# Altium schematic sheet Beacon.SchDoc
size A3
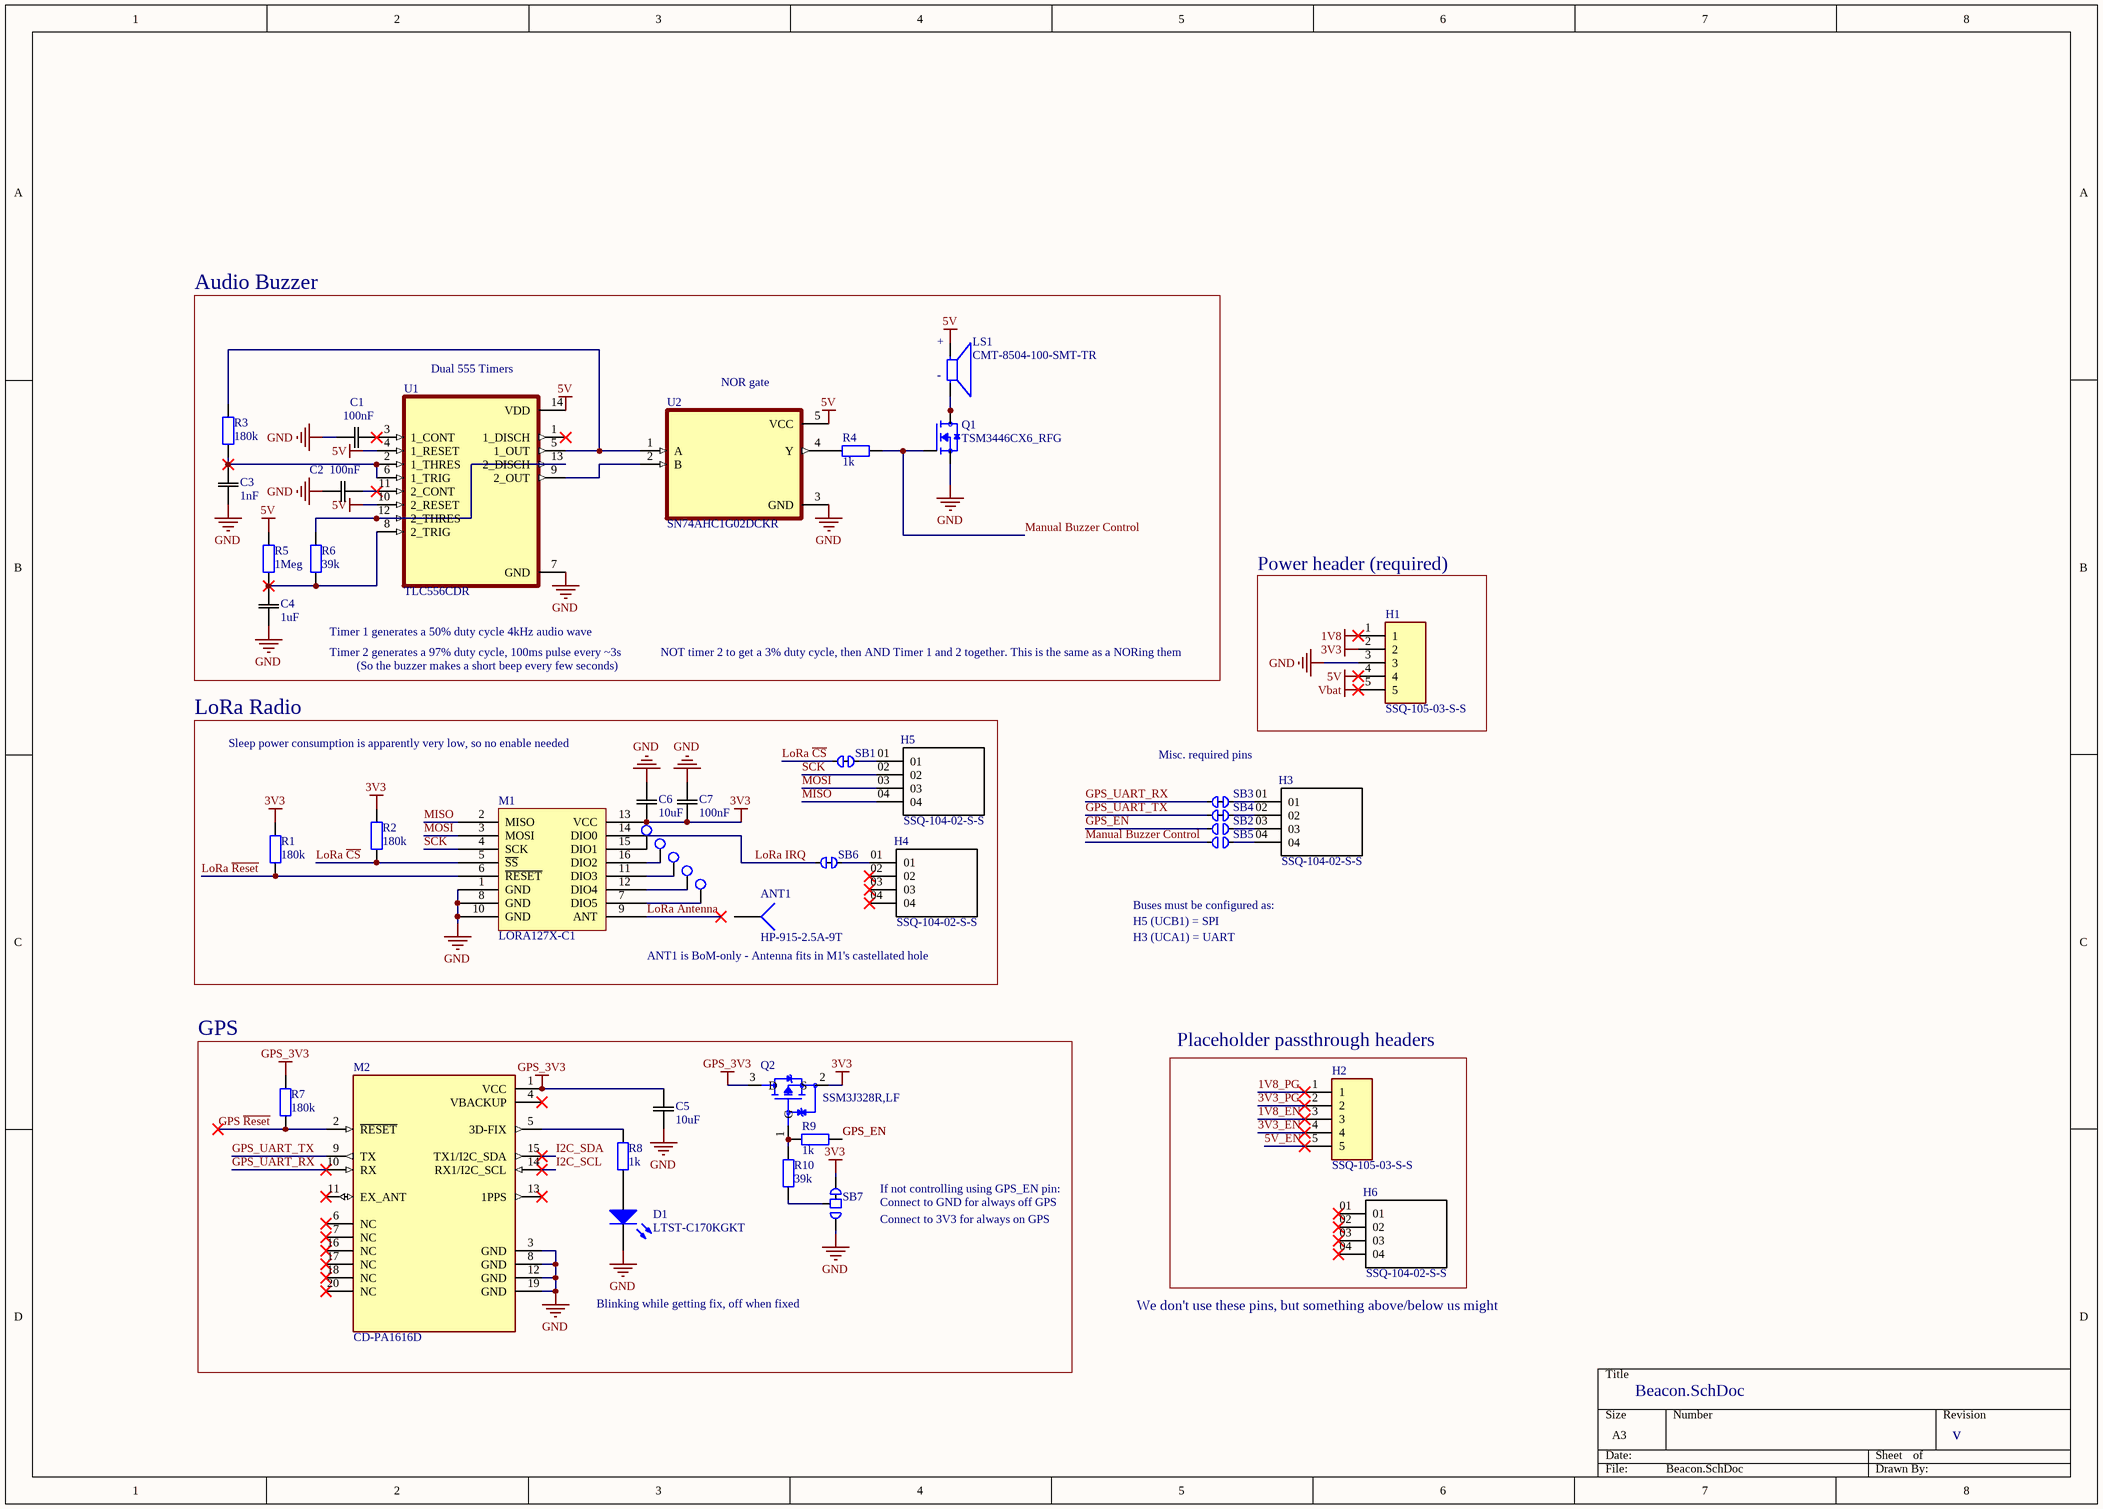
[diagram p0: Beacon.SchDoc]

## Parts
ANT1  HP-915-2.5A-9T  (mechanical)
C1  100nF  [CAPC2012X94N]
C2  100nF  [CAPC2012X94N]
C3  1nF  [CAPC2012X94N]
C4  1uF  [CAPC2012X94N]
C5  10uF  [CAPC2012X94N]
C6  10uF  [CAPC2012X94N]
C7  100nF  [CAPC2012X94N]
D1  LTST-C170KGKT  [ECE-LED2012-0805SM]
H1  SSQ-105-03-S-S  [SAMTEC_SSQ-105-03-S-S]  (no BOM)
H2  SSQ-105-03-S-S  [SAMTEC_SSQ-105-03-S-S]  (no BOM)
H3  SSQ-104-02-S-S  [*SAMTEC_SSQ-104-02-S-S_SSQ-104-02-S-S(Primary)]  (no BOM)
H4  SSQ-104-02-S-S  [*SAMTEC_SSQ-104-02-S-S_SSQ-104-02-S-S(Primary)]  (no BOM)
H5  SSQ-104-02-S-S  [*SAMTEC_SSQ-104-02-S-S_SSQ-104-02-S-S(Primary)]  (no BOM)
H6  SSQ-104-02-S-S  [*SAMTEC_SSQ-104-02-S-S_SSQ-104-02-S-S(Primary)]  (no BOM)
LS1  CMT-8504-100-SMT-TR  [XDCR_CMT-8504-100-SMT-TR]
M1  LORA127X-C1  [LoRa127X-C1]
M2  CD-PA1616D  [XCVR_CD-PA1616D]
Q1  TSM3446CX6_RFG  [SOT-26-6]
Q2  SSM3J328R,LF  [SOT95P240X88-3N]
R1  180k  [0805]
R2  180k  [0805]
R3  180k  [0805]
R4  1k  [0805]
R5  1Meg  [0805]
R6  39k  [0805]
R7  180k  [0805]
R8  1k  [0805]
R9  1k  [0805]
R10  39k  [0805]
SB1  Solder Jumper Normally Closed 0201  [Solder Bridge Closed 0201]  (value not drawn)  (net tie, no BOM)
SB2  Solder Jumper Normally Open 0201  [Solder Bridge Open 0201]  (value not drawn)  (no BOM)
SB3  Solder Jumper Normally Closed 0201  [Solder Bridge Closed 0201]  (value not drawn)  (net tie, no BOM)
SB4  Solder Jumper Normally Closed 0201  [Solder Bridge Closed 0201]  (value not drawn)  (net tie, no BOM)
SB5  Solder Jumper Normally Open 0201  [Solder Bridge Open 0201]  (value not drawn)  (no BOM)
SB6  Solder Jumper Normally Closed 0201  [Solder Bridge Closed 0201]  (value not drawn)  (net tie, no BOM)
SB7  Solder Jumper 3-pin Left connected 0201  [Solder Bridge 3-pin Left shorted 0201]  (value not drawn)  (net tie, no BOM)
T1  Test Pad  [Test Pad]  (value not drawn)  (no BOM)
T2  Test Pad  [Test Pad]  (value not drawn)  (no BOM)
T3  Test Pad  [Test Pad]  (value not drawn)  (no BOM)
T4  Test Pad  [Test Pad]  (value not drawn)  (no BOM)
T5  Test Pad  [Test Pad]  (value not drawn)  (no BOM)
U1  TLC556CDR  [SOIC127P600X175-14N]
U2  SN74AHC1G02DCKR  [SOT65P210X110-5N]

## Blocks framed on the sheet
Audio Buzzer: C1-C4 LS1 Q1 R3-R6 U1 U2
Power header (required): H1
LoRa Radio: ANT1 C6 C7 H4 H5 M1 R1 R2 SB1 SB6 T1-T5
GPS: C5 D1 M2 Q2 R7-R10 SB7
Placeholder passthrough headers: H2 H6

## Nets
1V8: H1.1
3V3: C6.2 C7.1 H1.2 M1.13(VCC) Q2.2(S) R1.2 R2.2 SB7.2
5V: H1.4 LS1.P R5.2 U1.4(1_RESET) U1.10(2_RESET) U1.14(VDD) U2.5(VCC)
GND: C1.1 C2.1 C3.1 C4.1 C5.1 C6.1 C7.2 D1.2(K) H1.3 M1.1(GND) M1.8(GND) M1.10(GND) M2.3(GND) M2.8(GND) M2.12(GND) M2.19(GND) Q1.4(S) SB7.3 U1.7(GND) U2.3(GND)
GPS_3V3: C5.2 M2.1(VCC) Q2.3(D) R7.2
Vbat: H1.5
1V8_EN: H2.3
1V8_PG: H2.1
3V3_EN: H2.4
3V3_PG: H2.2
5V_EN: H2.5
GPS ~{Reset}: M2.2(~{RESET}) R7.1
GPS_EN: R9.1 SB2.1
GPS_UART_RX: M2.10(RX) SB3.1
GPS_UART_TX: M2.9(TX) SB4.1
I2C_SCL: M2.14(RX1/I2C_SCL)
I2C_SDA: M2.15(TX1/I2C_SDA)
LoRa Antenna: M1.9(ANT)
LoRa ~{CS}: M1.5(~{SS}) R2.1 SB1.1
LoRa IRQ: M1.14(DIO0) SB6.1
LoRa ~{Reset}: M1.6(~{RESET}) R1.1
Manual Buzzer Control: Q1.3(G) R4.1 SB5.1
MISO: H5.04 M1.2(MISO)
MOSI: H5.03 M1.3(MOSI)
SCK: H5.02 M1.4(SCK)
NetC1_2: C1.2 U1.3(1_CONT)
NetC2_2: C2.2 U1.11(2_CONT)
NetC3_2: C3.2 R3.2 U1.2(1_THRES) U1.6(1_TRIG)
NetC4_2: C4.2 R5.1 R6.1 U1.8(2_TRIG)
NetD1_1: D1.1(A) R8.1
NetH3_01: H3.01 SB3.2
NetH3_02: H3.02 SB4.2
NetH3_03: H3.03 SB2.2
NetH3_04: H3.04 SB5.2
NetH4_01: H4.01 SB6.2
NetH5_01: H5.01 SB1.2
NetLS1_N: LS1.N Q1.1(D) Q1.2(D) Q1.5(D) Q1.6(D)
NetM1_7: M1.7(DIO5) T5.1
NetM1_11: M1.11(DIO3) T3.1
NetM1_12: M1.12(DIO4) T4.1
NetM1_15: M1.15(DIO1) T1.1
NetM1_16: M1.16(DIO2) T2.1
NetM2_5: M2.5(3D-FIX) R8.2
NetQ2_1: Q2.1(G) R9.2 R10.1
NetR3_1: R3.1 U1.5(1_OUT) U2.1(A)
NetR4_2: R4.2 U2.4(Y)
NetR6_2: R6.2 U1.12(2_THRES) U1.13(2_DISCH)
NetR10_2: R10.2 SB7.1(Common)
NetU1_9: U1.9(2_OUT) U2.2(B)

Not connected (* = marked no-connect by the designer): ANT1 1; H4 02* 03* 04*; H6 01* 02* 03* 04*; M2 4(VBACKUP)* 6(NC)* 7(NC)* 11(EX_ANT)* 13(1PPS)* 16(NC)* 17(NC)* 18(NC)* 20(NC)*; U1 1(1_DISCH)*

## Notes on the sheet
- (near U1) Dual 555 Timers
- (near U2) NOR gate
- Timer 1 generates a 50% duty cycle 4kHz audio wave
- Timer 2 generates a 97% duty cycle, 100ms pulse every ~3s
- (So the buzzer makes a short beep every few seconds)
- NOT timer 2 to get a 3% duty cycle, then AND Timer 1 and 2 together. This is the same as a NORing them
- Sleep power consumption is apparently very low, so no enable needed
- Misc. required pins
- Buses must be configured as:
- H5 (UCB1) = SPI
- ANT1 is BoM-only - Antenna fits in M1's castellated hole
- H3 (UCA1) = UART
- If not controlling using GPS_EN pin:
- (near SB7) Connect to GND for always off GPS
- (near SB7) Connect to 3V3 for always on GPS
- Blinking while getting fix, off when fixed
- (near H6) We don't use these pins, but something above/below us might
- v
- (in symbol CMT-8504-100-SMT-TR) +; -

## Library data of the parts
ANT1 = Socket: Spring Antenna
C1-C7 = CAP 0805: Capacitor; IsInLabBook: Yes
  C1 C2 C7: Value: 100nF
  C3: Value: 1nF
  C4: Value: 1uF
  C5 C6: Value: 10uF
D1 = LED
H1 H2 = SSQ-105-03-S-S: MF: {'manufacturer': u'Samtec Inc.'}; Package: None; Price: None; Value: *; MP: SSQ-105-03-S-S; Availability: Unavailable
LS1 = CMT-8504-100-SMT-TR: 8.5 mm, 5 Vo-p, 100 dB, Surface Mount (SMT), Magnetic Audio Transducer Buzzer; MF: CUI Devices; Package: CUI Devices; Purchase-URL: https://pricing.snapeda.com/search/part/CMT-8504-100-SMT-TR/?ref=eda; MP: CMT-8504-100-SMT-TR; Price: None; Availability: In Stock; Check_prices: https://www.snapeda.com/parts/CMT-8504-100-SMT-TR/CUI+Devices/view-part/?ref=eda; Value: *; SnapEDA_Link: https://www.snapeda.com/parts/CMT-8504-100-SMT-TR/CUI+Devices/view-part/?ref=snap; CUI_purchase_URL: https://www.cuidevices.com/product/audio/buzzers/audio-transducers/cmt-8504-100-smt-tr?utm_source=snapeda.com&utm_medium=referral&utm_campaign=snapedaBOM
M1 = LORA127X-C1: LoRa transceiver
M2 = CD-PA1616D: CD-PA1616D GNSS patch antenna module; MF: CD Top; Package: Package; Price: None; Value: *; Check_prices: https://www.snapeda.com/parts/CD-PA1616D/CD+Top/view-part/?ref=eda; SnapEDA_Link: https://www.snapeda.com/parts/CD-PA1616D/CD+Top/view-part/?ref=snap; MP: CD-PA1616D; Availability: Not in stock
Q1 = TSM3446CX6_RFG: N-channel MOSFET; MF: {'manufacturer': u'Taiwan Semiconductor'}; Package: None; Price: None; Value: *; MP: TSM3446CX6_RFG; Availability: Unavailable
Q2 = SSM3J328R,LF: P-Channel MOSFET 20V 6A _Ta_ 1W _Ta_ Surface Mount SOT-23F; MF: Toshiba; MP: SSM3J328R,LF; SnapEDA_Link: https://www.snapeda.com/parts/SSM3J328R,LF/Toshiba%20Semiconductor%20and%20Storage/view-part/214715/?ref=snap; Availability: Unavailable; Package: SOT-23 Toshiba; Value: *; Price: None
R1-R10 = Resistor: IsInLabBook: Yes
  R1-R3 R7: Value: 180k
  R4 R8 R9: Value: 1k
  R5: Value: 1Meg
  R6 R10: Value: 39k
SB7 = Solder Jumper 3-pin Normally Closed 0201: DEBUG: DEBUG
U1 = TLC556CDR: Dual 555 Timer; Package: None; Price: None; Value: *; MP: TLC556CDR; Availability: Unavailable
U2 = SN74AHC1G02DCKR: NOR gate; Package: None; Price: None; Value: *; MP: SN74AHC1G02DCKR; Availability: Unavailable
H3-H6 = SSQ-104-02-S-S: SnapEDA_Link: https://www.snapeda.com/parts/SSQ-104-02-S-S/Samtec/view-part/?ref=snap; Check_prices: https://www.snapeda.com/parts/SSQ-104-02-S-S/Samtec/view-part/?ref=eda; Value: *
SB1 SB3 SB4 SB6 = Solder Jumper Normally Closed 0201: DEBUG: DEBUG
SB2 SB5 = Solder Jumper Normally Open 0201: DEBUG: DEBUG